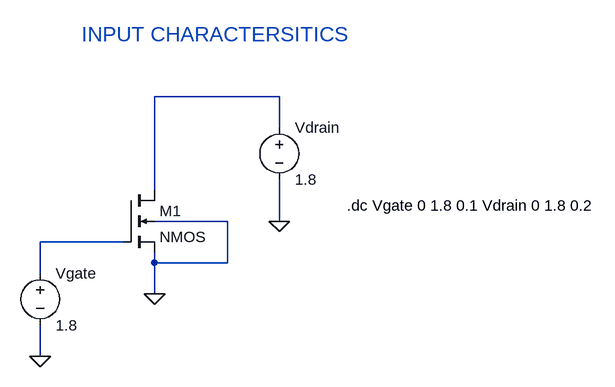
[diagram p0: schematic 8)input_charactersitics.asc]
8)input_charactersitics.asc, the LTspice schematic file:
Version 4
SHEET 1 880 680
WIRE 320 -32 128 -32
WIRE 320 16 320 -32
WIRE 128 112 128 -32
WIRE 240 160 128 160
WIRE 320 160 320 96
WIRE 80 192 -48 192
WIRE 128 224 128 208
WIRE 240 224 240 160
WIRE 240 224 128 224
WIRE -48 240 -48 192
WIRE 128 272 128 224
WIRE -48 368 -48 320
FLAG 128 272 0
FLAG -48 368 0
FLAG 320 160 0
SYMBOL nmos4 80 112 R0
SYMATTR InstName M1
SYMBOL voltage 320 0 R0
WINDOW 123 0 0 Left 0
WINDOW 39 0 0 Left 0
SYMATTR InstName Vdrain
SYMATTR Value 1.8
SYMBOL voltage -48 224 R0
WINDOW 123 0 0 Left 0
WINDOW 39 0 0 Left 0
SYMATTR InstName Vgate
SYMATTR Value 1.8
TEXT 424 136 Left 2 !.dc Vgate 0 1.8 0.1 Vdrain 0 1.8 0.2
TEXT 16 -128 Left 3 ;INPUT CHARACTERSITICS

The netlist it stands for:
* 8)input_charactersitics.asc
M1 N001 N002 0 0 NMOS
Vdrain N001 0 1.8
Vgate N002 0 1.8
.model NMOS NMOS
.model PMOS PMOS
.lib standard.mos
.dc Vgate 0 1.8 0.1 Vdrain 0 1.8 0.2
* INPUT CHARACTERSITICS
.backanno
.end